# Altium schematic sheet Sheet1.SchDoc
size A4; SheetNumber: 3; SheetTotal: 3
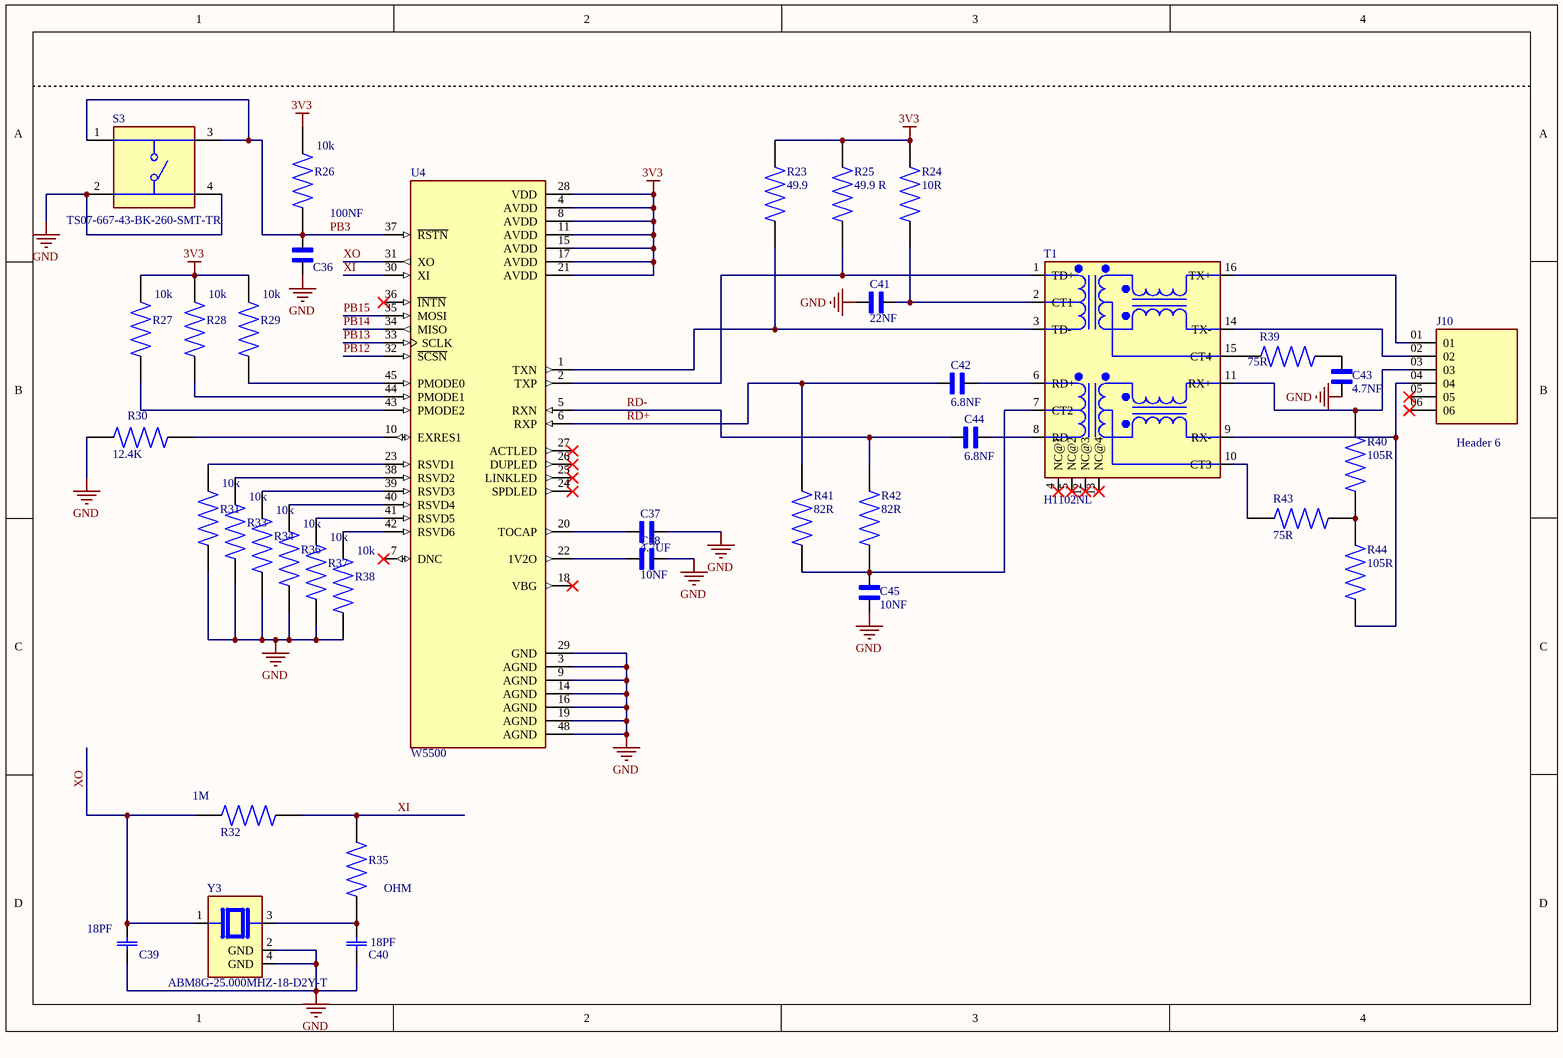
[diagram p0: Sheet1.SchDoc]

## Parts
C36  100NF  [CAPC1608X90]
C37  4.7UF  [CAPC2012X135N]
C38  10NF  [CAPC1608X90]
C39  18PF  [CAPC1608X85N]
C40  18PF  [CAPC1608X85N]
C41  22NF  [CAPC1608X90]
C42  6.8NF  [CAPC1608X90]
C43  4.7NF  [CAPC1608X90]
C44  6.8NF  [CAPC1608X90]
C45  10NF  [CAPC1608X90]
J10  Header 6  [SAMTEC_MTLW-106-06-G-S-180]
R23  49.9  [RESC3116X65N]
R24  10R  [RESC3116X65N]
R25  49.9 R  [RESC3116X65N]
R26  10k  [RESC3116X65N]
R27  10k  [RESC3116X65N]
R28  10k  [RESC3116X65N]
R29  10k  [RESC3116X65N]
R30  12.4K  [RESC3116X65N]
R31  10k  [RESC3116X65N]
R32  1M  [RESC3116X65N]
R33  10k  [RESC3116X65N]
R34  10k  [RESC3116X65N]
R35  OHM  [RESC3116X65N]
R36  10k  [RESC3116X65N]
R37  10k  [RESC3116X65N]
R38  10k  [RESC3116X65N]
R39  75R  [RESC3116X65N]
R40  105R  [RESC3116X65N]
R41  82R  [RESC3116X65N]
R42  82R  [RESC3116X65N]
R43  75R  [RESC3116X65N]
R44  105R  [RESC3116X65N]
S3  TS07-667-43-BK-260-SMT-TR  [SW_TS07-667-43-BK-260-SMT-TR]
T1  H1102NL  [H1102NL]
U4  W5500  [QFP50P900X900X160-48N]
Y3  ABM8G-25.000MHZ-18-D2Y-T  [XTAL_ABM8G-25.000MHZ-18-D2Y-T]

## Nets
3V3: R23.1 R24.1 R25.1 R26.2 R27.2 R28.2 R29.2 U4.4(AVDD) U4.8(AVDD) U4.11(AVDD) U4.15(AVDD) U4.17(AVDD) U4.21(AVDD) U4.28(VDD)
GND: C36.1 C37.2 C38.1 C39.1(C1) C40.1(C1) C41.2 C43.2 C45.2 R30.2 R31.1 R33.1 R34.1 R36.1 R37.1 R38.1 S3.2 S3.4 U4.3(AGND) U4.9(AGND) U4.14(AGND) U4.16(AGND) U4.19(AGND) U4.29(GND) U4.48(AGND) Y3.2(GND) Y3.4(GND)
PB3: C36.2 R26.1 S3.1 S3.3 U4.37(~{RSTN})
PB12: U4.32(~{SCSN})
PB13: U4.33(SCLK)
PB14: U4.34(MISO)
PB15: U4.35(MOSI)
RD+: C42.2 R41.1 U4.6(RXP)
RD-: C44.2 R42.1 U4.5(RXN)
XI: R32.1 R35.2 U4.30(XI)
XO: C39.2(C2) R32.2 U4.31(XO) Y3.1
NetC37_1: C37.1 U4.20(TOCAP)
NetC38_2: C38.2 U4.22(1V2O)
NetC40_2: C40.2(C2) R35.1 Y3.3
NetC41_1: C41.1 R24.2 T1.2(CT1)
NetC42_1: C42.1 T1.6(RD+)
NetC43_1: C43.1 R39.2
NetC44_1: C44.1 T1.8(RD-)
NetC45_1: C45.1 R41.2 R42.2 T1.7(CT2)
NetJ10_01: J10.01 T1.16(TX+)
NetJ10_02: J10.02 T1.14(TX-)
NetJ10_03: J10.03 R40.1 T1.11(RX+)
NetJ10_04: J10.04 R44.2 T1.9(RX-)
NetR23_2: R23.2 T1.3(TD-) U4.1(TXN)
NetR25_2: R25.2 T1.1(TD+) U4.2(TXP)
NetR27_1: R27.1 U4.43(PMODE2)
NetR28_1: R28.1 U4.44(PMODE1)
NetR29_1: R29.1 U4.45(PMODE0)
NetR30_1: R30.1 U4.10(EXRES1)
NetR31_2: R31.2 U4.23(RSVD1)
NetR33_2: R33.2 U4.38(RSVD2)
NetR34_2: R34.2 U4.39(RSVD3)
NetR36_2: R36.2 U4.40(RSVD4)
NetR37_2: R37.2 U4.41(RSVD5)
NetR38_2: R38.2 U4.42(RSVD6)
NetR39_1: R39.1 T1.15(CT4)
NetR40_2: R40.2 R43.2 R44.1
NetR43_1: R43.1 T1.10(CT3)

Not connected (* = marked no-connect by the designer): J10 05* 06*; T1 4(NC@1)* 5(NC@2)* 12(NC@3)* 13(NC@4)*; U4 7(DNC)* 18(VBG)* 24(SPDLED)* 25(LINKLED)* 26(DUPLED)* 27(ACTLED)* 36(~{INTN})*

## Library data of the parts
C36 C38 C41-C45 = C0603C104J3RACTU: 0603 C 100nF Ceramic Multilayer Capacitor, 25 V, +125degC, X7R Dielectric, +/-5% | KEMET C0603C104J3RACTU; SnapEDA_Link: https://www.snapeda.com/parts/C0603C104J3RACTU/KEMET/view-part/?ref=snap; Package: 603-2 KEMET; Value: *; MF: KEMET; MP: C0603C104J3RACTU; Check_prices: https://www.snapeda.com/parts/C0603C104J3RACTU/KEMET/view-part/?ref=eda
C37 = CL21B225KPFNNNG: 2.2 ÂµF Â±10% 10V Ceramic Capacitor X7R 0805 (2012 Metric); MF: Samsung; SnapEDA_Link: https://www.snapeda.com/parts/CL21B225KPFNNNG/Samsung/view-part/?ref=snap; Package: SMD-2 Samsung; Value: *; MP: CL21B225KPFNNNG; Check_prices: https://www.snapeda.com/parts/CL21B225KPFNNNG/Samsung/view-part/?ref=eda
C39 C40 = C0603C200J5GACTU: Capacitor Ceramic C0G 0603 50V 20pF | KEMET C0603C200J5GACTU; SnapEDA_Link: https://www.snapeda.com/parts/C0603C200J5GACTU/KEMET/view-part/?ref=snap; Package: 0603 Kemet; Value: *; MF: KEMET; MP: C0603C200J5GACTU; Check_prices: https://www.snapeda.com/parts/C0603C200J5GACTU/KEMET/view-part/?ref=eda
J10 = MTLW-106-06-G-S-180: Package: None; MP: MTLW-106-06-G-S-180; Price: None; Availability: Unavailable; Value: *
R23-R44 = AC1206FR-070RL: 0 Ohms Jumper Chip Resistor 1206 (3216 Metric) Automotive AEC-Q200 Thick Film; MF: Yageo; SnapEDA_Link: https://www.snapeda.com/parts/AC1206FR-070RL/Yageo/view-part/?ref=snap; Package: SMD-2 Yageo; Value: *; MP: AC1206FR-070RL; Check_prices: https://www.snapeda.com/parts/AC1206FR-070RL/Yageo/view-part/?ref=eda
S3 = TS07-667-43-BK-260-SMT-TR: 6 x 6.7 mm, 4.3 mm Actuator Height, 260 gf, Black, Surface Mount, SPST, Tactile Switch; MF: Same Sky; SnapEDA_Link: https://www.snapeda.com/parts/TS07-667-43-BK-260-SMT-TR/Same+Sky/view-part/?ref=snap; Package: None; Value: *; MP: TS07-667-43-BK-260-SMT-TR; Check_prices: https://www.snapeda.com/parts/TS07-667-43-BK-260-SMT-TR/Same+Sky/view-part/?ref=eda
T1 = H1102NL: - Isolation and Data Interface (Encapsulated) Pulse Transformer 1:1 Transmitter, 1:1 Receiver Surface Mount; SnapEDA_Link: https://www.snapeda.com/parts/H1102NL/Pulse/view-part/?ref=snap; Package: Non Standard Pulse; Value: *; MF: Pulse; MP: H1102NL; Check_prices: https://www.snapeda.com/parts/H1102NL/Pulse/view-part/?ref=eda
U4 = W5500: Hardwired TCP/IP embedded Ethernet controller; Availability: Unavailable; MP: W5500; Value: *; Price: None; Package: None
Y3 = ABM8G-25.000MHZ-18-D2Y-T: 25 MHz Â±20ppm Crystal 18pF 60 Ohms 4-SMD, No Lead; MF: Abracon; Value: *; SnapEDA_Link: https://www.snapeda.com/parts/ABM8G-25.000MHZ-18-D2Y-T/Abracon+LLC/view-part/?ref=snap; Purchase-URL: https://pricing.snapeda.com/search/part/ABM8G-25.000MHZ-18-D2Y-T/?ref=eda; Availability: In Stock; Price: None; Package: SMD-4 Abracon; Check_prices: https://www.snapeda.com/parts/ABM8G-25.000MHZ-18-D2Y-T/Abracon+LLC/view-part/?ref=eda; MP: ABM8G-25.000MHZ-18-D2Y-T